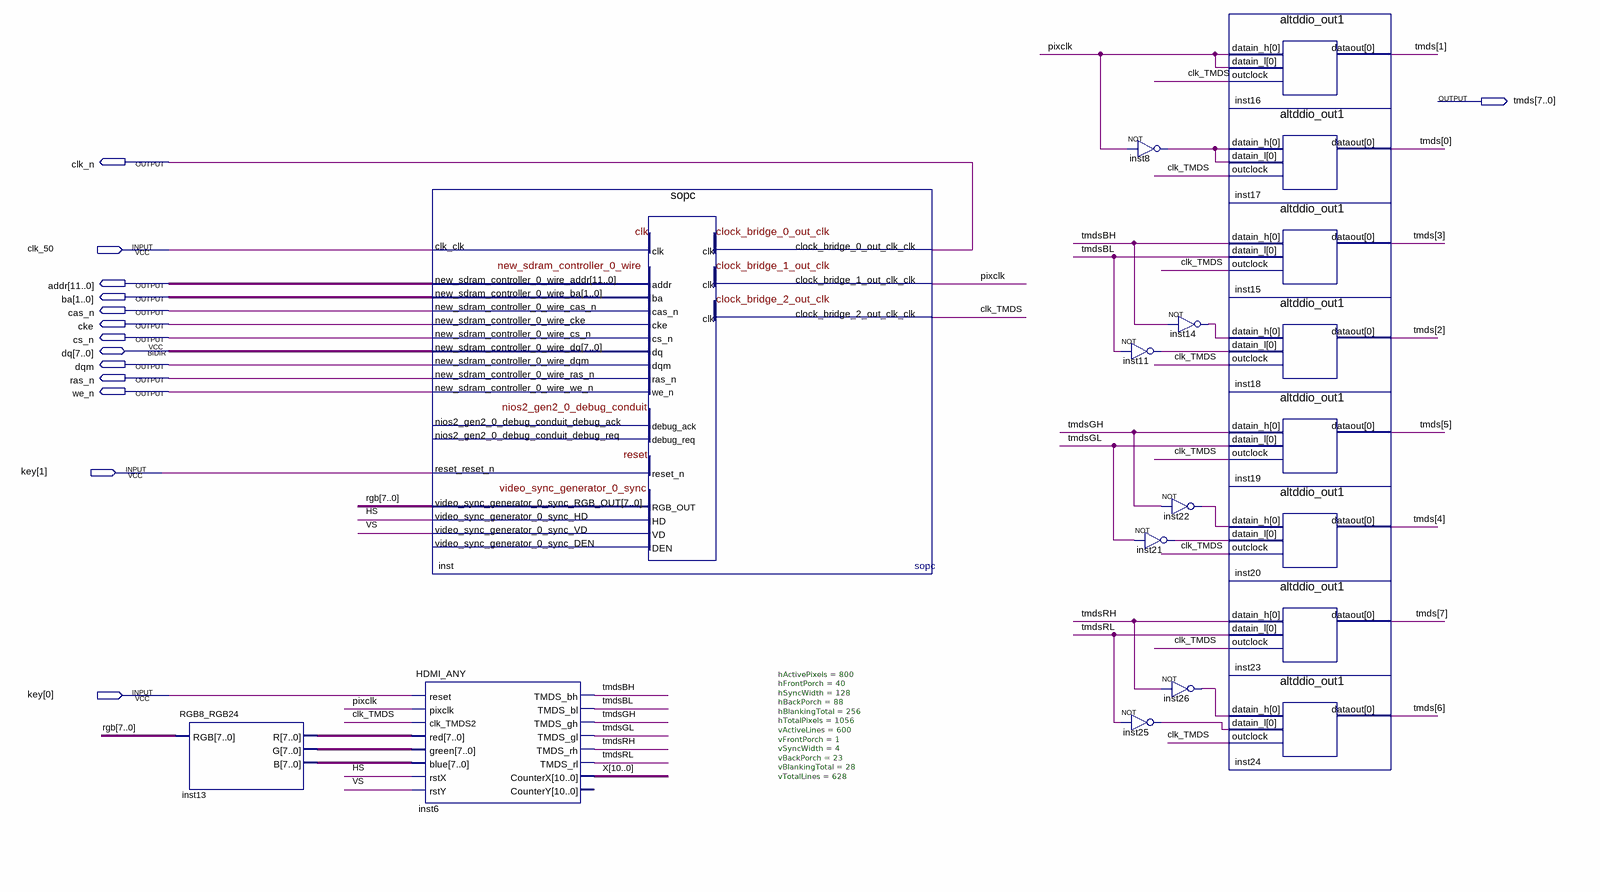
[diagram p0: schematic sheet]
// Quartus schematic frame_buffer_top.bdf as structural Verilog: 18 symbols, 14 pins
module frame_buffer_top (
  input  clk_50,
  input  [1:0] key,
  inout  [7:0] dq,
  output [7:0] tmds,
  output clk_n,
  output [11:0] addr,
  output [1:0] ba,
  output cas_n,
  output cke,
  output cs_n,
  output dqm,
  output ras_n,
  output we_n
);

  wire clk_TMDS, HS, inst8_out, inst11_out, inst14_out, inst21_out, inst22_out, inst25_out, inst26_out,
       pixclk, tmdsBH, tmdsBL, tmdsGH, tmdsGL, tmdsRH, tmdsRL, VS;
  wire [7:0] inst13_b, inst13_g, inst13_r, rgb;
  wire [10:0] X;

  RGB8_RGB24 inst13 (.RGB(rgb), .R(inst13_r), .G(inst13_g), .B(inst13_b));
  sopc inst (
    .clk_clk(clk_50), .reset_reset_n(key[1]), .clock_bridge_0_out_clk_clk(clk_n),
    .clock_bridge_1_out_clk_clk(pixclk), .clock_bridge_2_out_clk_clk(clk_TMDS),
    .new_sdram_controller_0_wire_addr(addr), .new_sdram_controller_0_wire_ba(ba),
    .new_sdram_controller_0_wire_cas_n(cas_n), .new_sdram_controller_0_wire_cke(cke),
    .new_sdram_controller_0_wire_cs_n(cs_n), .new_sdram_controller_0_wire_dqm(dqm),
    .new_sdram_controller_0_wire_ras_n(ras_n), .new_sdram_controller_0_wire_we_n(we_n),
    .video_sync_generator_0_sync_RGB_OUT(rgb), .video_sync_generator_0_sync_HD(HS),
    .video_sync_generator_0_sync_VD(VS), .new_sdram_controller_0_wire_dq(dq));  // open: nios2_gen2_0_debug_conduit_debug_req, nios2_gen2_0_debug_conduit_debug_ack, video_sync_generator_0_sync_DEN
  HDMI_ANY #(.hActivePixels(800), .hFrontPorch(40), .hSyncWidth(128), .hBackPorch(88), .hBlankingTotal(256), .hTotalPixels(1056), .vActiveLines(600), .vFrontPorch(1), .vSyncWidth(4), .vBackPorch(23), .vBlankingTotal(28), .vTotalLines(628)) inst6 (
    .reset(key[0]), .pixclk(pixclk), .clk_TMDS2(clk_TMDS), .red(inst13_r), .green(inst13_g), .blue(inst13_b),
    .rstX(HS), .rstY(VS), .TMDS_bh(tmdsBH), .TMDS_bl(tmdsBL), .TMDS_gh(tmdsGH), .TMDS_gl(tmdsGL),
    .TMDS_rh(tmdsRH), .TMDS_rl(tmdsRL), .CounterX(X));  // open: CounterY
  not inst8 (inst8_out, pixclk);
  not inst11 (inst11_out, tmdsBL);
  not inst22 (inst22_out, tmdsGH);
  not inst21 (inst21_out, tmdsGL);
  not inst26 (inst26_out, tmdsRH);
  not inst25 (inst25_out, tmdsRL);
  not inst14 (inst14_out, tmdsBH);
  altddio_out1 inst16 (.datain_h(pixclk), .datain_l(pixclk), .outclock(clk_TMDS), .dataout(tmds[1]));
  altddio_out1 inst17 (.datain_h(inst8_out), .datain_l(inst8_out), .outclock(clk_TMDS), .dataout(tmds[0]));
  altddio_out1 inst15 (.datain_h(tmdsBH), .datain_l(tmdsBL), .outclock(clk_TMDS), .dataout(tmds[3]));
  altddio_out1 inst18 (.datain_h(inst14_out), .datain_l(inst11_out), .outclock(clk_TMDS), .dataout(tmds[2]));
  altddio_out1 inst19 (.datain_h(tmdsGH), .datain_l(tmdsGL), .outclock(clk_TMDS), .dataout(tmds[5]));
  altddio_out1 inst20 (.datain_h(inst22_out), .datain_l(inst21_out), .outclock(clk_TMDS), .dataout(tmds[4]));
  altddio_out1 inst23 (.datain_h(tmdsRH), .datain_l(tmdsRL), .outclock(clk_TMDS), .dataout(tmds[7]));
  altddio_out1 inst24 (.datain_h(inst26_out), .datain_l(inst25_out), .outclock(clk_TMDS), .dataout(tmds[6]));
endmodule
